# EAGLE schematic MIC_amp (EAGLE 5.07)
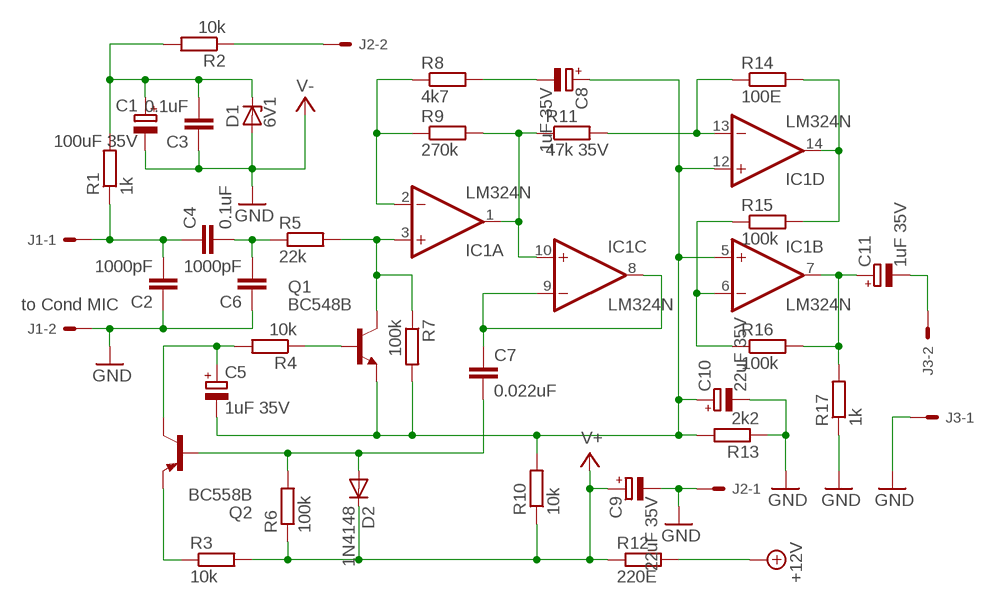
[diagram p0: schematic, sheet 1]

## Parts
C1  100uF 35V  CPOL-EUE2.5-6  [E2,5-6]
C2  1000pF  C-EU050-035X075  [C050-035X075]
C3  0.1uF  C-EU050-035X075  [C050-035X075]
C4  0.1uF  C-EU050-035X075  [C050-035X075]
C5  1uF 35V  CPOL-EUE2.5-6  [E2,5-6]
C6  1000pF  C-EU050-035X075  [C050-035X075]
C7  0.022uF  C-EU050-035X075  [C050-035X075]
C8  1uF 35V  CPOL-EUE2.5-6  [E2,5-6]
C9  22uF 35V  CPOL-EUE2.5-6  [E2,5-6]
C10  22uF 35V  CPOL-EUE2.5-6  [E2,5-6]
C11  1uF 35V  CPOL-EUE2.5-6  [E2,5-6]
D1  6V1  ZENER-DIODEDO35Z10  [DO35Z10]
D2  1N4148  1N4148DO35-10  [DO35-10]
IC1  LM324N  [DIL14]
J1  22-27-2021-02  [6410-02]
J2  22-27-2021-02  [6410-02]
J3  22-27-2021-02  [6410-02]
Q1  BC548B  [TO92-EBC]
Q2  BC558B  [TO92-EBC]
R1  1k  R-EU_0207/12  [0207/12]
R2  10k  R-EU_0207/12  [0207/12]
R3  10k  R-EU_0207/12  [0207/12]
R4  10k  R-EU_0207/12  [0207/12]
R5  22k  R-EU_0207/12  [0207/12]
R6  100k  R-EU_0207/12  [0207/12]
R7  100k  R-EU_0207/12  [0207/12]
R8  4k7  R-EU_0207/12  [0207/12]
R9  270k  R-EU_0207/12  [0207/12]
R10  10k  R-EU_0207/12  [0207/12]
R11  47k 35V  R-EU_0207/12  [0207/12]
R12  220E  R-EU_0207/12  [0207/12]
R13  2k2  R-EU_0207/12  [0207/12]
R14  100E  R-EU_0207/12  [0207/12]
R15  100k  R-EU_0207/12  [0207/12]
R16  100k  R-EU_0207/12  [0207/12]
R17  1k  R-EU_0207/12  [0207/12]

## Nets
+12V: J2.2 R2.1 R12.2
GND: C1.- C2.1 C3.1 C6.1 C9.- C10.- D1.A J1.2 J2.1 J3.1 R13.1 R17.1 ; supply symbol labelled V-
N$1: IC1.2(A:-IN) R8.1 R9.1
N$2: IC1.1(A:OUT) IC1.10(C:+IN) R9.2 R11.1
N$3: IC1.13(D:-IN) R11.2 R14.1
N$4: IC1.3(A:+IN) Q1.C R5.2 R7.1
N$5: IC1.14(D:OUT) R14.2 R15.2
N$6: IC1.6(B:-IN) R15.1 R16.1
N$7: C11.+ IC1.7(B:OUT) R16.2 R17.2
N$8: C7.1 IC1.8(C:OUT) IC1.9(C:-IN)
N$9: C8.- R8.2
N$10: C5.- C8.+ C10.+ IC1.5(B:+IN) IC1.12(D:+IN) Q1.E R7.2 R10.2 R13.2
N$11: C7.2 D2.A Q2.B R6.2
N$12: Q1.B R4.1
N$13: C5.+ Q2.C R4.2
N$14: Q2.E R3.1
N$16: C1.+ C3.2 D1.C R1.2 R2.2
N$17: C2.2 C4.1 J1.1 R1.1
N$18: C4.2 C6.2 R5.1
N$24: C11.- J3.2
V+: C9.+ D2.C R3.2 R6.1 R10.1 R12.1

## Notes on the sheet
- to Cond MIC

## Power pins joined to a net without a drawn wire
V+: IC1.4(P:V+)
V-: IC1.11(P:V-)

## Library data of the parts
C1 C5 C8-C11 = rcl:CPOL-EU: POLARIZED CAPACITOR, European symbol
C2-C4 C6 C7 = rcl:C-EU: CAPACITOR, European symbol
D1 = diode:ZENER-DIODE: Z-Diode
D2 = diode:1N4148: DIODE high speed (Philips)
IC1 = linear:LM324: OP AMP
J1-J3 = con-molex:22-?-02: CONNECTOR wire to board 2.54 mm (.1 inch) pitch header
Q1 = transistor-npn:BC548*: NPN Transistor
Q2 = transistor-pnp:BC558*: PNP Transistror
R1-R17 = rcl:R-EU_: RESISTOR, European symbol